# Altium schematic sheet Sheet3.SchDoc
size A1; SheetNumber: 3; SheetTotal: 3
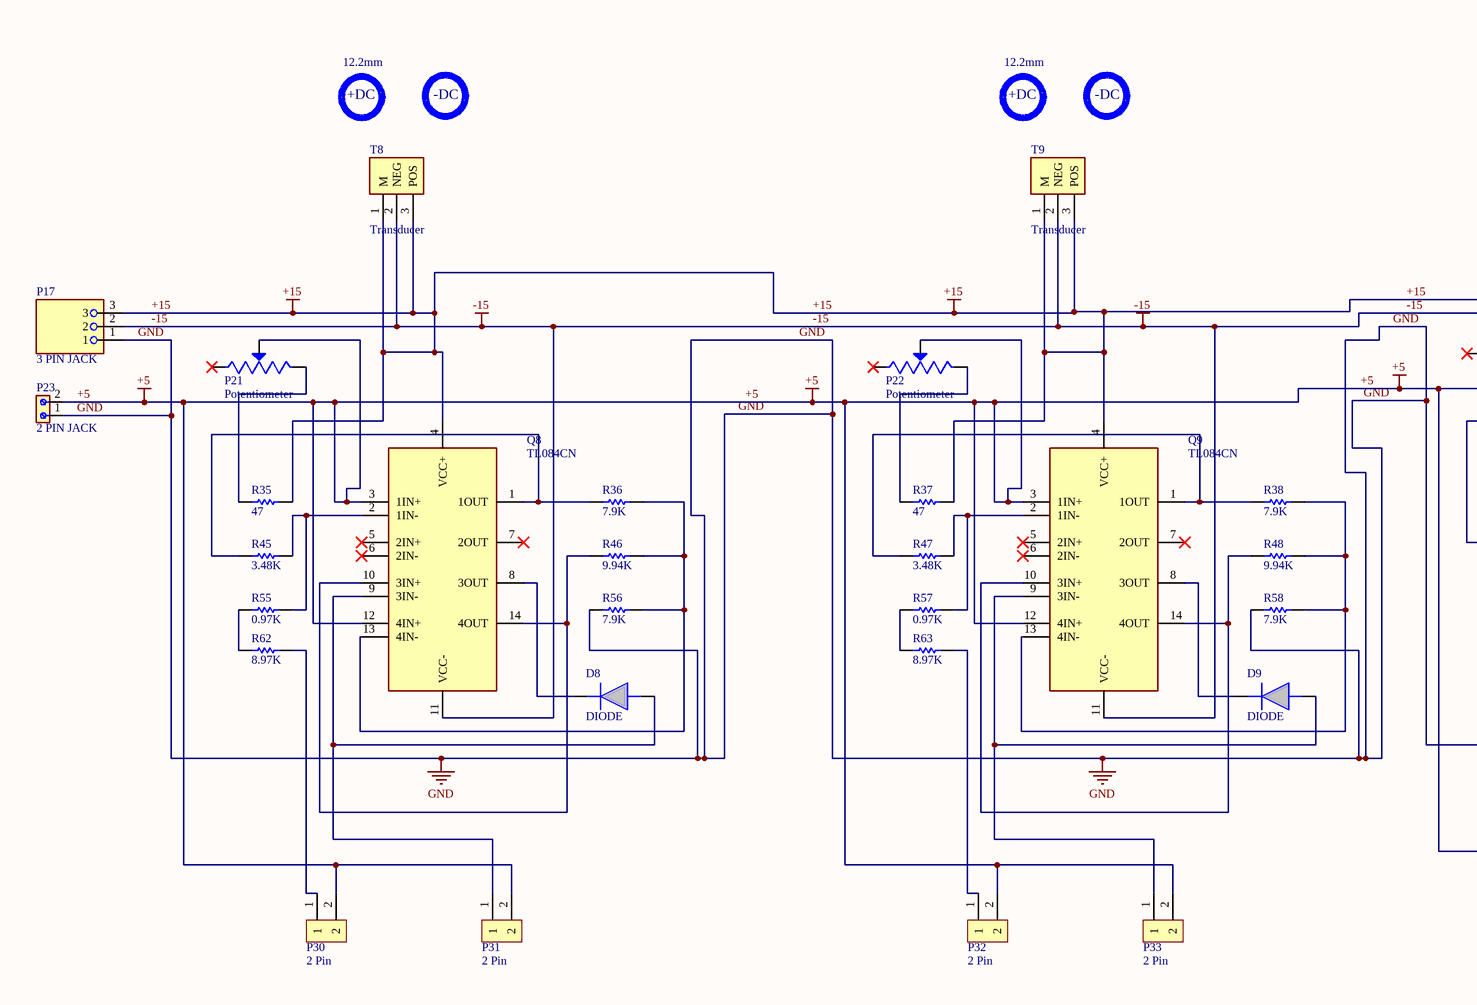
[diagram p0: Sheet3.SchDoc, left]
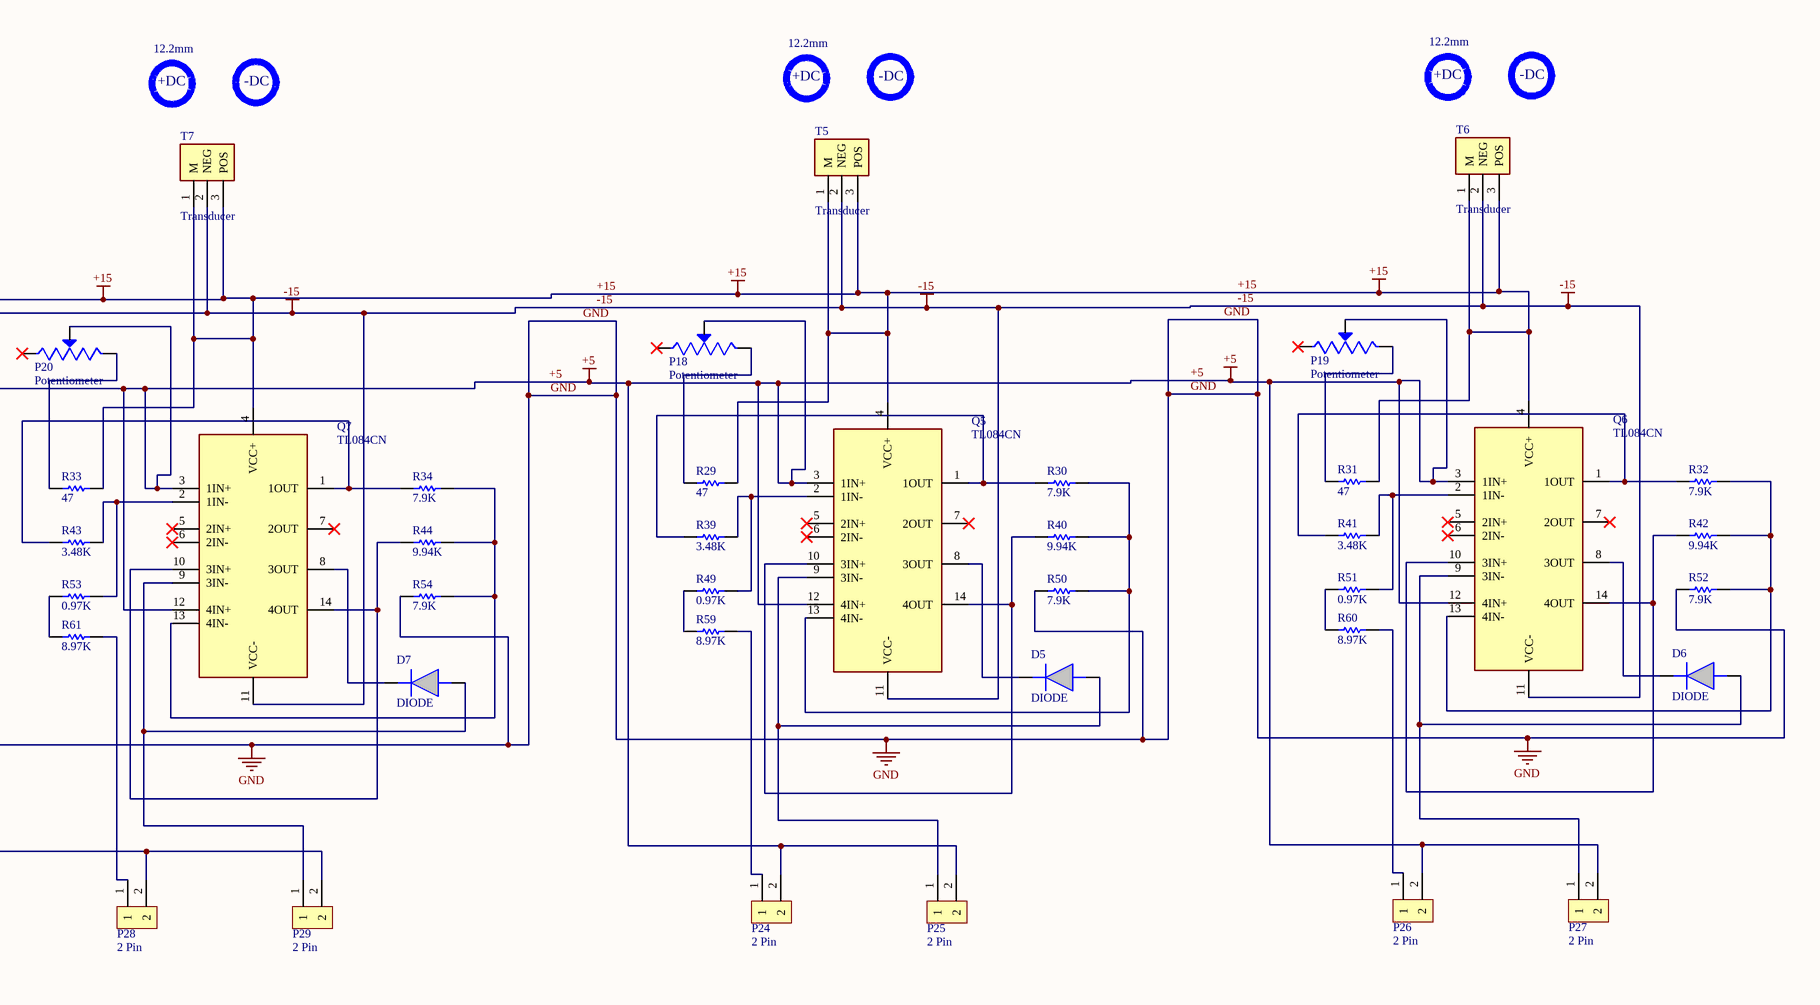
[diagram p1: Sheet3.SchDoc, right]

## Parts
D5  DIODE  [Diode]
D6  DIODE  [Diode]
D7  DIODE  [Diode]
D8  DIODE  [Diode]
D9  DIODE  [Diode]
P17  3 PIN JACK  [3 PIN JACK]
P18  Potentiometer  [Potentiometer]
P19  Potentiometer  [Potentiometer]
P20  Potentiometer  [Potentiometer]
P21  Potentiometer  [Potentiometer]
P22  Potentiometer  [Potentiometer]
P23  2 PIN JACK  [2 PIN JACK]
P24  2 Pin  [2 PIN]
P25  2 Pin  [2 PIN]
P26  2 Pin  [2 PIN]
P27  2 Pin  [2 PIN]
P28  2 Pin  [2 PIN]
P29  2 Pin  [2 PIN]
P30  2 Pin  [2 PIN]
P31  2 Pin  [2 PIN]
P32  2 Pin  [2 PIN]
P33  2 Pin  [2 PIN]
Q5  TL084CN  [TL084CN]
Q6  TL084CN  [TL084CN]
Q7  TL084CN  [TL084CN]
Q8  TL084CN  [TL084CN]
Q9  TL084CN  [TL084CN]
R29  47  [47]
R30  7.9K  [7.90K]
R31  47  [47]
R32  7.9K  [7.90K]
R33  47  [47]
R34  7.9K  [7.90K]
R35  47  [47]
R36  7.9K  [7.90K]
R37  47  [47]
R38  7.9K  [7.90K]
R39  3.48K  [3.48K]
R40  9.94K  [9.94K]
R41  3.48K  [3.48K]
R42  9.94K  [9.94K]
R43  3.48K  [3.48K]
R44  9.94K  [9.94K]
R45  3.48K  [3.48K]
R46  9.94K  [9.94K]
R47  3.48K  [3.48K]
R48  9.94K  [9.94K]
R49  0.97K  [0.97K]
R50  7.9K  [7.90K]
R51  0.97K  [0.97K]
R52  7.9K  [7.90K]
R53  0.97K  [0.97K]
R54  7.9K  [7.90K]
R55  0.97K  [0.97K]
R56  7.9K  [7.90K]
R57  0.97K  [0.97K]
R58  7.9K  [7.90K]
R59  8.97K  [8.97K]
R60  8.97K  [8.97K]
R61  8.97K  [8.97K]
R62  8.97K  [8.97K]
R63  8.97K  [8.97K]
T5  Transducer  [Transducer]
T6  Transducer  [Transducer]
T7  Transducer  [Transducer]
T8  Transducer  [Transducer]
T9  Transducer  [Transducer]

## Nets
+5: P18.2(WIPER) P19.2(WIPER) P20.2(WIPER) P21.2(WIPER) P22.2(WIPER) P23.2 P24.2 P25.2 P26.2 P27.2 P28.2 P29.2 P30.2 P31.2 P32.2 P33.2 Q5.3(1IN+) Q5.12(4IN+) Q6.3(1IN+) Q6.12(4IN+) Q7.3(1IN+) Q7.12(4IN+) Q8.3(1IN+) Q8.12(4IN+) Q9.3(1IN+) Q9.12(4IN+)
+15: P17.3 Q5.4(VCC+) Q6.4(VCC+) Q7.4(VCC+) Q8.4(VCC+) Q9.4(VCC+) R29.2 R31.2 R33.2 R35.2 R37.2 T5.1(M) T5.3(POS) T6.1(M) T6.3(POS) T7.1(M) T7.3(POS) T8.1(M) T8.3(POS) T9.1(M) T9.3(POS)
-15: P17.2 Q5.11(VCC-) Q6.11(VCC-) Q7.11(VCC-) Q8.11(VCC-) Q9.11(VCC-) T5.2(NEG) T6.2(NEG) T7.2(NEG) T8.2(NEG) T9.2(NEG)
GND: P17.1 P23.1 R50.1 R52.1 R54.1 R56.1 R58.1
NetD5_1: D5.1(K) Q5.8(3OUT)
NetD5_2: D5.2(A) P25.1 Q5.9(3IN-)
NetD6_1: D6.1(K) Q6.8(3OUT)
NetD6_2: D6.2(A) P27.1 Q6.9(3IN-)
NetD7_1: D7.1(K) Q7.8(3OUT)
NetD7_2: D7.2(A) P29.1 Q7.9(3IN-)
NetD8_1: D8.1(K) Q8.8(3OUT)
NetD8_2: D8.2(A) P31.1 Q8.9(3IN-)
NetD9_1: D9.1(K) Q9.8(3OUT)
NetD9_2: D9.2(A) P33.1 Q9.9(3IN-)
NetP18_3: P18.3(CW) R29.1
NetP19_3: P19.3(CW) R31.1
NetP20_3: P20.3(CW) R33.1
NetP21_3: P21.3(CW) R35.1
NetP22_3: P22.3(CW) R37.1
NetP24_1: P24.1 R59.2
NetP26_1: P26.1 R60.2
NetP28_1: P28.1 R61.2
NetP30_1: P30.1 R62.2
NetP32_1: P32.1 R63.2
NetQ5_1: Q5.1(1OUT) R30.1 R39.1
NetQ5_2: Q5.2(1IN-) R39.2 R49.2
NetQ5_10: Q5.10(3IN+) Q5.14(4OUT) R40.1
NetQ5_13: Q5.13(4IN-) R30.2 R40.2 R50.2
NetQ6_1: Q6.1(1OUT) R32.1 R41.1
NetQ6_2: Q6.2(1IN-) R41.2 R51.2
NetQ6_10: Q6.10(3IN+) Q6.14(4OUT) R42.1
NetQ6_13: Q6.13(4IN-) R32.2 R42.2 R52.2
NetQ7_1: Q7.1(1OUT) R34.1 R43.1
NetQ7_2: Q7.2(1IN-) R43.2 R53.2
NetQ7_10: Q7.10(3IN+) Q7.14(4OUT) R44.1
NetQ7_13: Q7.13(4IN-) R34.2 R44.2 R54.2
NetQ8_1: Q8.1(1OUT) R36.1 R45.1
NetQ8_2: Q8.2(1IN-) R45.2 R55.2
NetQ8_10: Q8.10(3IN+) Q8.14(4OUT) R46.1
NetQ8_13: Q8.13(4IN-) R36.2 R46.2 R56.2
NetQ9_1: Q9.1(1OUT) R38.1 R47.1
NetQ9_2: Q9.2(1IN-) R47.2 R57.2
NetQ9_10: Q9.10(3IN+) Q9.14(4OUT) R48.1
NetQ9_13: Q9.13(4IN-) R38.2 R48.2 R58.2
NetR49_1: R49.1 R59.1
NetR51_1: R51.1 R60.1
NetR53_1: R53.1 R61.1
NetR55_1: R55.1 R62.1
NetR57_1: R57.1 R63.1

Not connected (* = marked no-connect by the designer): P18 1(CCW)*; P19 1(CCW)*; P20 1(CCW)*; P21 1(CCW)*; P22 1(CCW)*; Q5 5(2IN+)* 6(2IN-)* 7(2OUT)*; Q6 5(2IN+)* 6(2IN-)* 7(2OUT)*; Q7 5(2IN+)* 6(2IN-)* 7(2OUT)*; Q8 5(2IN+)* 6(2IN-)* 7(2OUT)*; Q9 5(2IN+)* 6(2IN-)* 7(2OUT)*

## Notes on the sheet
- 12.2mm
- +DC
- -DC

## Library data of the parts
D5-D9 = DIODE: 1N4007S
P24-P33 = 2 Pin: 22272021
R29 R31 R33 R35 R37 = 47: MFR-25FRF52-47R
R30 R32 R34 R36 R38 R50 R52 R54 R56 R58 = 7.9K: MFR-25FBF52-7K87
R39 R41 R43 R45 R47 = 3.48K: MFR-25FBF52-3K48
R40 R42 R44 R46 R48 = 9.94K: MFR-25FTE52-9K76
R49 R51 R53 R55 R57 = 0.97K: MFR-25FRF52-976R
R59-R63 = 8.97K: MFR-25FBF52-8K87
T5-T9 = Transducer: LA55-P